# EAGLE design VM_Motor_v2.1 (EAGLE 7.0.0)
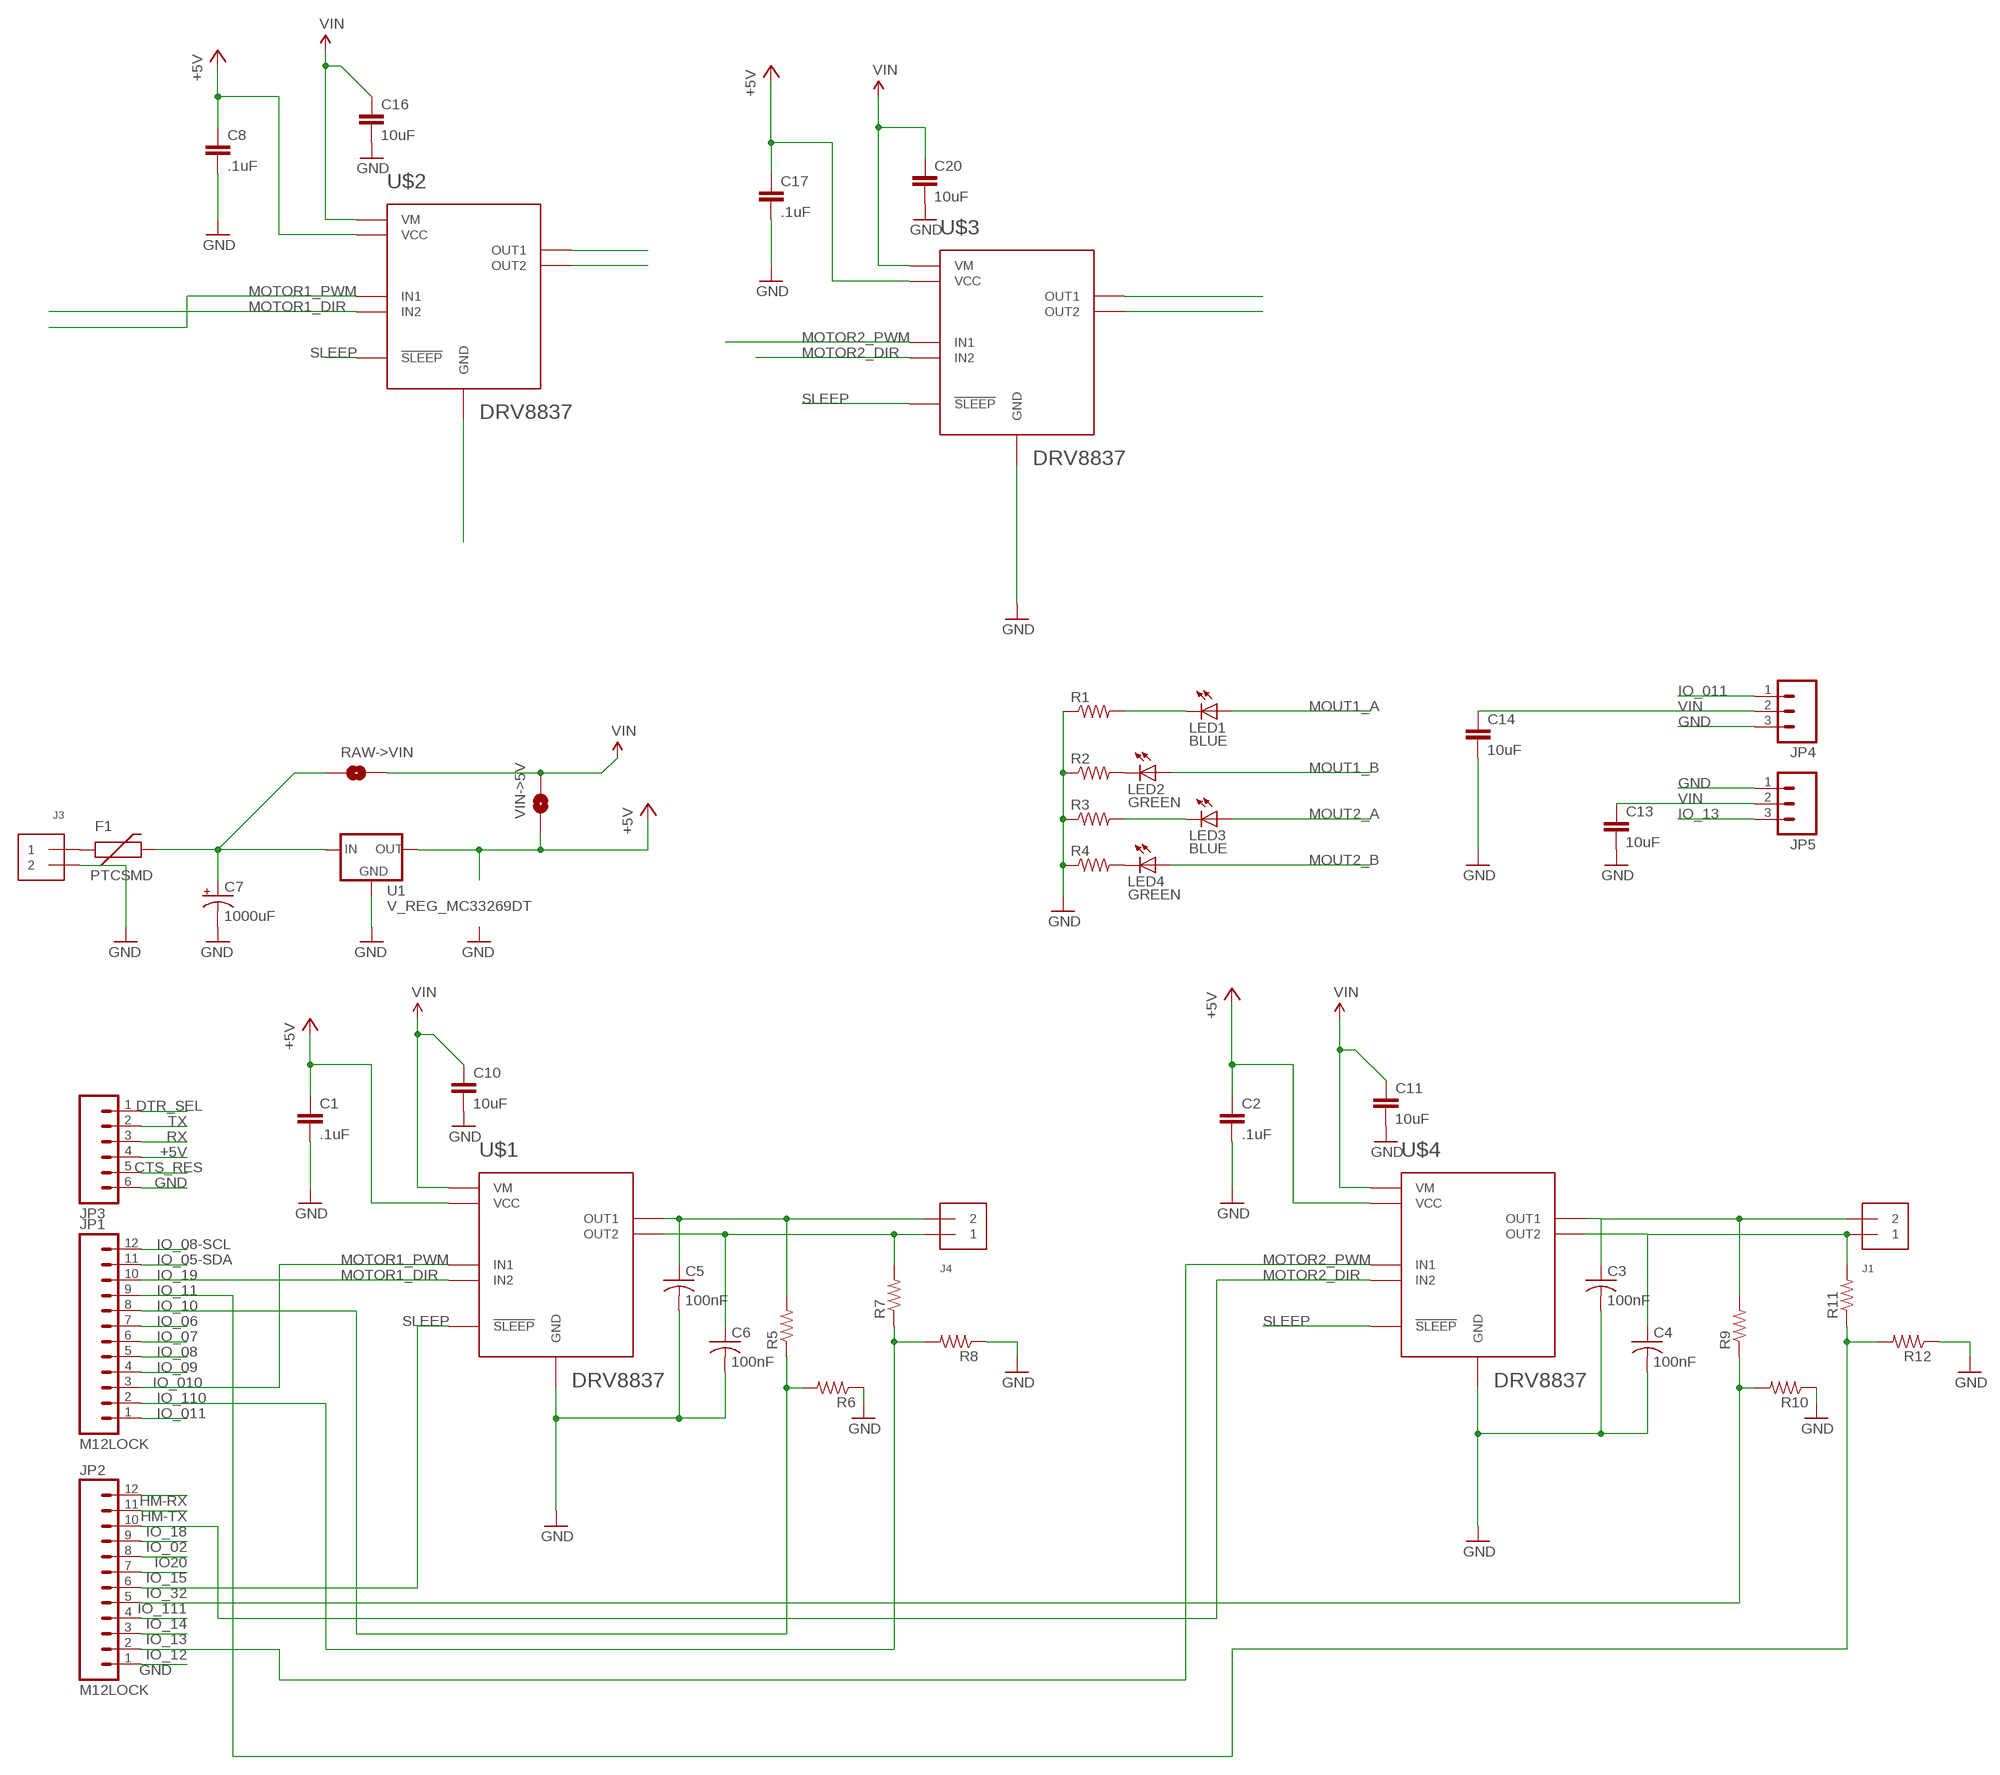
[diagram p0: schematic, sheet 1]

## Parts
C1  .1uF  CAP0402-CAP  [0402-CAP]
C2  .1uF  CAP0402-CAP  [0402-CAP]
C3  100nF  C-USC0402  [C0402]
C4  100nF  C-USC0402  [C0402]
C5  100nF  C-USC0402  [C0402]
C6  100nF  C-USC0402  [C0402]
C7  1000uF  CPOL-US150CLZ-0810  [150CLZ-0810]
C8  .1uF  CAP0402-CAP  [0402-CAP]
C10  10uF  CAP0402-CAP  [0402-CAP]
C11  10uF  CAP0402-CAP  [0402-CAP]
C13  10uF  CAP0402-CAP  [0402-CAP]
C14  10uF  CAP0402-CAP  [0402-CAP]
C16  10uF  CAP0402-CAP  [0402-CAP]
C17  .1uF  CAP0402-CAP  [0402-CAP]
C20  10uF  CAP0402-CAP  [0402-CAP]
F1  PTCSMD  [PTC-1206]
J1  TERMBLOCK_1X2  [TERMBLOCK_1X2-3.5MM]
J3  TERMBLOCK_1X2  [TERMBLOCK_1X2-3.5MM]
J4  TERMBLOCK_1X2  [TERMBLOCK_1X2-3.5MM]
JP1  M12LOCK  [1X12_LOCK]
JP2  M12LOCK  [1X12_LOCK]
JP3  M06LOCK  [1X06_LOCK]
JP4  M03LOCK  [1X03_LOCK]
JP5  M03LOCK  [1X03_LOCK]
LED1  BLUE  LEDCHIP-LED0603  [CHIP-LED0603]
LED2  GREEN  LEDCHIP-LED0603  [CHIP-LED0603]
LED3  BLUE  LEDCHIP-LED0603  [CHIP-LED0603]
LED4  GREEN  LEDCHIP-LED0603  [CHIP-LED0603]
R1  R-US_R0402  [R0402]
R2  R-US_R0402  [R0402]
R3  R-US_R0402  [R0402]
R4  R-US_R0402  [R0402]
R5  R-US_R0402  [R0402]
R6  R-US_R0402  [R0402]
R7  R-US_R0402  [R0402]
R8  R-US_R0402  [R0402]
R9  R-US_R0402  [R0402]
R10  R-US_R0402  [R0402]
R11  R-US_R0402  [R0402]
R12  R-US_R0402  [R0402]
RAW->VIN  SOLDERJUMPERNO  [SJ_2S-NO]
U1  V_REG_MC33269DT  [DPAK]
U$1  DRV8837  [QFN8]
U$2  DRV8837  [QFN8]
U$3  DRV8837  [QFN8]
U$4  DRV8837  [QFN8]
VIN->5V  SOLDERJUMPERNO  [SJ_2S-NO]

## Nets
+5V: C1.1 C2.1 C8.1 C17.1 JP3.4 U1.4(OUT) U$1.P$8(VCC) U$2.P$8(VCC) U$3.P$8(VCC) U$4.P$8(VCC) VIN->5V.1
CTS_RES: JP3.5
DTR_SEL: JP3.1
GND: C1.2 C2.2 C3.2 C4.2 C5.2 C6.2 C7.- C8.2 C10.2 C11.2 C13.2 C14.2 C16.2 C17.2 C20.2 J3.2 JP2.1 JP3.6 JP4.3 JP5.1 R1.1 R2.1 R3.1 R4.1 R6.1 R8.1 R10.1 R12.1 U1.1(GND) U$1.P$4(GND) U$1.P$9(GND) U$1.P$10(GND) U$1.P$11(GND) U$2.P$4(GND) U$2.P$9(GND) U$2.P$10(GND) U$2.P$11(GND) U$3.P$4(GND) U$3.P$9(GND) U$3.P$10(GND) U$3.P$11(GND) U$4.P$4(GND) U$4.P$9(GND) U$4.P$10(GND) U$4.P$11(GND)
HM-RX: JP2.12
HM-TX: JP2.11
IO20: JP2.8
IO_02: JP2.9
IO_05-SDA: JP1.11
IO_06: JP1.7
IO_07: JP1.6
IO_08: JP1.5
IO_08-SCL: JP1.12
IO_09: JP1.4
IO_10: JP1.8 R5.1 R6.2
IO_011: JP1.1 JP4.1
IO_11: JP1.9 R11.1 R12.2
IO_13: JP2.3 JP5.3
IO_14: JP2.4
IO_15: JP2.7
IO_110: JP1.2 R7.1 R8.2
IO_111: JP2.5 R9.1 R10.2
MOTOR1_DIR: JP1.10 U$1.P$5(IN2) U$2.P$5(IN2)
MOTOR1_PWM: JP1.3 U$1.P$6(IN1) U$2.P$6(IN1)
MOTOR2_DIR: JP2.10 U$3.P$5(IN2) U$4.P$5(IN2)
MOTOR2_PWM: JP2.2 U$3.P$6(IN1) U$4.P$6(IN1)
MOUT1_A: C5.1 J4.2 LED1.A R5.2 U$1.P$2(OUT1) U$2.P$2(OUT1)
MOUT1_B: C6.1 J4.1 LED2.A R7.2 U$1.P$3(OUT2) U$2.P$3(OUT2)
MOUT2_A: C3.1 J1.2 LED3.A R9.2 U$3.P$2(OUT1) U$4.P$2(OUT1)
MOUT2_B: C4.1 J1.1 LED4.A R11.2 U$3.P$3(OUT2) U$4.P$3(OUT2)
N$1: LED2.C R2.2
N$2: LED4.C R4.2
N$3: LED1.C R1.2
N$4: LED3.C R3.2
N$13: F1.1 J3.1
RAW: C7.+ F1.2 RAW->VIN.1 U1.3(IN)
RX: JP3.3
SLEEP: JP2.6 U$1.P$7(!SLEEP) U$2.P$7(!SLEEP) U$3.P$7(!SLEEP) U$4.P$7(!SLEEP)
TX: JP3.2
VIN: C10.1 C11.1 C13.1 C14.1 C16.1 C20.1 JP4.2 JP5.2 RAW->VIN.2 U$1.P$1(VM) U$2.P$1(VM) U$3.P$1(VM) U$4.P$1(VM) VIN->5V.2

## Notes on the sheet
- IO_19
- IO_11
- IO_010
- IO_18
- IO_32
- IO_12

## Library data of the parts
C1 C2 C8 C10 C11 C13 C14 C16 C17 C20 = SparkFun-Capacitors:CAP: Capacitor Standard 0603 ceramic capacitor, and 0.1" leaded capacitor.
C3-C6 = resistor:C-US: CAPACITOR, American symbol
C7 = resistor:CPOL-US: POLARIZED CAPACITOR, American symbol
F1 = SparkFun-PowerIC:PTC: Resettable Fuse PTC Resettable Fuse. Spark Fun Electronics SKU : COM-08357; PROD_ID: RES-11150
J1 J3 J4 = microbuilder:TERMBLOCK_1X2: 3.5mm Terminal block http://www.ladyada.net/library/pcb/eaglelibrary.html
JP1 JP2 = SparkFun-Connectors:M12: Header 12 Standard 12-pin 0.1" header. Use with straight break away headers (SKU : PRT-00116), right angle break away headers (PRT-00553), swiss pins (PRT-00743), machine pins (PRT-00117), and female headers (PRT-00115).
JP3 = SparkFun-Connectors:M06: Header 6 Standard 6-pin 0.1" header. Use with straight break away headers (SKU : PRT-00116), right angle break away headers (PRT-00553), swiss pins (PRT-00743), machine pins (PRT-00117), and female headers (PRT-00115). Molex polarized connector foot print use with SKU : PRT-08094 with associated crimp pins and housings. NOTES ON THE VARIANTS LOCK and LOCK_LONGPADS... This footprint was designed to help hold the alignment of a through-hole component (i.e. 6-pin header) while soldering it into place. You may notice that each hole has been shifted either up or down by 0.005 of an inch from it's more standard position (which is a perfectly straight line). This slight alteration caused the pins (the squares in the middle) to touch the edges of the holes. Because they are alternating, it causes a "brace" to hold the component in place. 0.005 has proven to be the perfect amount of "off-center" position when using our standard breakaway headers. Although looks a little odd when you look at the bare footprint, once you have a header in there, the alteration is very hard to notice. Also,if you push a header all the way into place, it is covered up entirely on the bottom side. This idea of altering the position of holes to aid alignment will be further integrated into the Sparkfun Library for other footprints. It can help hold any component with 3 or more connection pins.
JP4 JP5 = SparkFun-Connectors:M03: Header 3 Standard 3-pin 0.1" header. Use with straight break away headers (SKU : PRT-00116), right angle break away headers (PRT-00553), swiss pins (PRT-00743), machine pins (PRT-00117), and female headers (PRT-00115). Molex polarized connector foot print use with SKU : PRT-08232 with associated crimp pins and housings.
LED1-LED4 = led:LED: LED OSRAM: - CHIPLED LG R971, LG N971, LY N971, LG Q971, LY Q971, LO R971, LY R971 LH N974, LH R974 LS Q976, LO Q976, LY Q976 LO Q996 - Hyper CHIPLED LW Q18S LB Q993, LB Q99A, LB R99A - SideLED LS A670, LO A670, LY A670, LG A670, LP A670 LB A673, LV A673, LT A673, LW A673 LH A674 LY A675 LS A676, LA A676, LO A676, LY A676, LW A676 LS A679, LY A679, LG A679 - Hyper Micro SIDELED® LS Y876, LA Y876, LO Y876, LY Y876 LT Y87S - SmartLED LW L88C, LW L88S LB L89C, LB L89S, LG L890 LS L89K, LO L89K, LY L89K LS L896, LA L896, LO L896, LY L896 - TOPLED LS T670, LO T670, LY T670, LG T670, LP T670 LSG T670, LSP T670, LSY T670, LOP T670, LYG T670 LG T671, LOG T671, LSG T671 LB T673, LV T673, LT T673, LW T673 LH T674 LS T676, LA T676, LO T676, LY T676, LB T676, LH T676, LSB T676, LW T676 LB T67C, LV T67C, LT T67C, LS T67K, LO T67K, LY T67K, LW E67C LS E67B, LA E67B, LO E67B, LY E67B, LB E67C, LV E67C, LT E67C LW T67C LS T679, LY T679, LG T679 LS T770, LO T770, LY T770, LG T770, LP T770 LB T773, LV T773, LT T773, LW T773 LH T774 LS E675, LA E675, LY E675, LS T675 LS T776, LA T776, LO T776, LY T776, LB T776 LHGB T686 LT T68C, LB T68C - Hyper Mini TOPLED® LB M676 - Mini TOPLED Santana® LG M470 LS M47K, LO M47K, LY M47K Source: http://www.osram.convergy.de LUXEON: - LUMILED® LXK2-PW12-R00, LXK2-PW12-S00, LXK2-PW14-U00, LXK2-PW14-V00 LXK2-PM12-R00, LXK2-PM12-S00, LXK2-PM14-U00 LXK2-PE12-Q00, LXK2-PE12-R00, LXK2-PE12-S00, LXK2-PE14-T00, LXK2-PE14-U00 LXK2-PB12-K00, LXK2-PB12-L00, LXK2-PB12-M00, LXK2-PB14-N00, LXK2-PB14-P00, LXK2-PB14-Q00 LXK2-PR12-L00, LXK2-PR12-M00, LXK2-PR14-Q00, LXK2-PR14-R00 LXK2-PD12-Q00, LXK2-PD12-R00, LXK2-PD12-S00 LXK2-PH12-R00, LXK2-PH12-S00 LXK2-PL12-P00, LXK2-PL12-Q00, LXK2-PL12-R00 Source: www.luxeon.com KINGBRIGHT: KA-3528ASYC Source: www.kingbright.com
R1-R12 = resistor:R-US_: RESISTOR, American symbol
RAW->VIN VIN->5V = SparkFun-Retired:SOLDERJUMPER: Solder Jumper Standard SMD solder jumper. Used to automate production. Two varients : Normally Open and Normally Closed are the same, but have different paste layers. NC will have a large amount of paste and should jumper during reflow.
U1 = SparkFun-PowerIC:V_REG_MC33269
U$1-U$4 = bt_motordriver:DRV8837: DRV8837 Low Voltage H-Bridge The DRV8837 provides an integrated motor-driver solution for cameras, consumer products, toys, and other low-voltage or battery-powered motion-control applications. The device has one H-bridge driver, and can drive one dc motor or one winding of a stepper motor, as well as other devices like solenoids. Reference: http://www.ti.com/lit/ds/symlink/drv8837.pdf

## Board
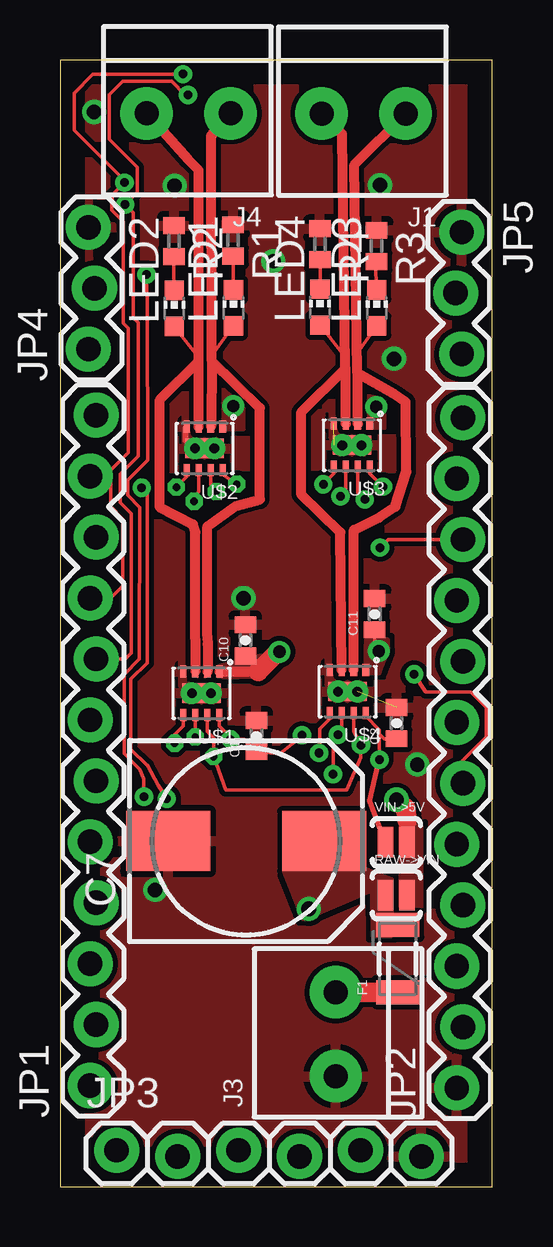
[diagram p1: board, top side]
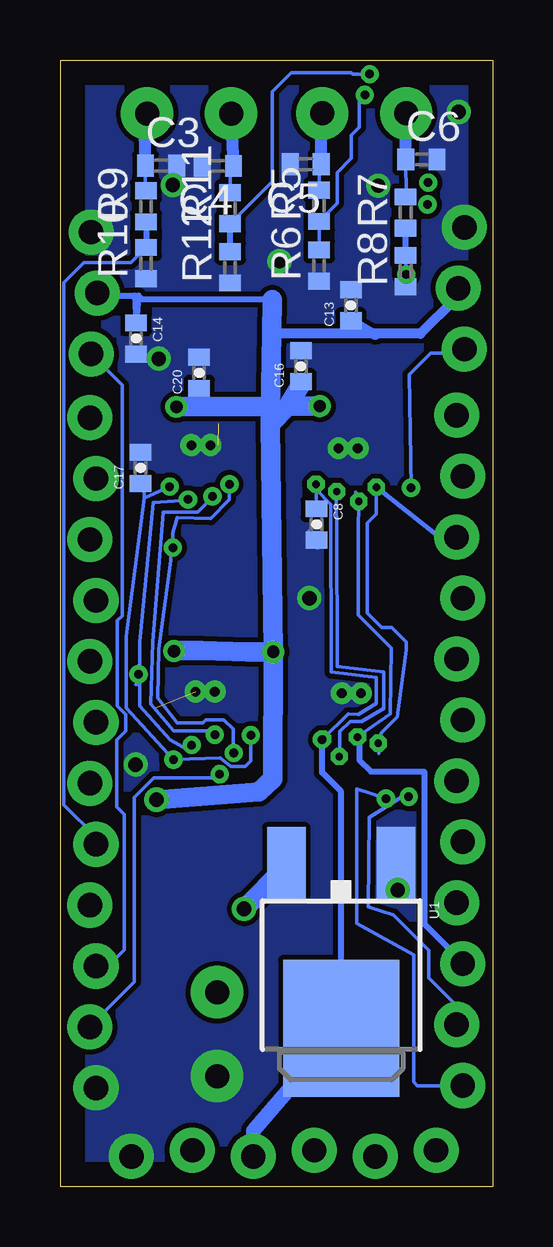
[diagram p2: board, bottom side, seen from below]

Size 18 x 46.97 mm. Coordinates in mm from the lower left corner, seen from the top.
Outline: 0,0 18,0 18,46.97 0,46.97 0,0
Copper layers (1*16): Top 0.035mm / dielectric 1.5mm / Bottom 0.035mm
Design rules "default": minimum track width 10mil, minimum drill 24mil, track to track 8mil, track to pad 8mil, pad to pad 8mil, via to via 8mil, smd to smd 8mil, copper to edge 40mil, drill to drill 8mil, minimum pad ring 10mil, minimum via ring 8mil, stop-mask expansion 4mil, vias tented up to drill 0mil, thermal gap 10mil

### Footprints (pad centres in the part's own frame; a part is rotated, then mirrored left to right if it is on the bottom)
0402-CAP = smd 0.7 x 0.9: 1 -0.65,0; 2 0.65,0
C0402 = smd 0.7 x 0.9: 1 -0.65,0; 2 0.65,0
150CLZ-0810 = smd 3.5 x 2.5: + 3.25,0; - -3.25,0
PTC-1206 = smd 1 x 1.8: 1 -1.4,0; 2 1.4,0
TERMBLOCK_1X2-3.5MM = drill 1 pad 2.184: 1 1.8,0; 2 -1.7,0
1X12_LOCK = drill 1.016 pad 1.88: 1 0,0.127; 2 2.54,-0.127; 3 5.08,0.127; 4 7.62,-0.127; 5 10.16,0.127; 6 12.7,-0.127; 7 15.24,0.127; 8 17.78,-0.127; 9 20.32,0.127; 10 22.86,-0.127; 11 25.4,0.127; 12 27.94,-0.127
1X06_LOCK = drill 1.016 pad 1.88: 1 0,0; 2 2.54,-0.254; 3 5.08,0; 4 7.62,-0.254; 5 10.16,0; 6 12.7,-0.254
1X03_LOCK = drill 1.016 pad 1.88: 1 0,0.127; 2 2.54,-0.127; 3 5.08,0.127
CHIP-LED0603 = smd 0.8 x 0.8: A 0,-0.75; C 0,0.75
R0402 = smd 0.7 x 0.9: 1 -0.65,0; 2 0.65,0
SJ_2S-NO = smd 0.635 x 1.27: 1 -0.45,0; 2 0.45,0
DPAK = smd 1.6 x 3: 1 -2.28,-5.31; 3 2.28,-5.31 | smd 4.826 x 5.715: 4 0,1.588
QFN8 = smd 0.28 x 0.5: P$1 -0.75,-0.9; P$2 -0.25,-0.9 | smd 0.25 x 0.5: P$3 0.25,-0.9; P$4 0.75,-0.9; P$5 0.75,0.9; P$6 0.25,0.9; P$7 -0.25,0.9; P$8 -0.75,0.9 | smd 1.6 x 0.8: P$9 0,0 | drill 0.4 pad 0.6: P$10 0.4,0; P$11 -0.4,0

### Placement (x,y rotation side)
C1  8.18,18.79 90 top
C2  14.03,19.32 90 top
C3  13.82,42.57 0 bottom
C4  11.45,42.55 180 bottom
C5  7.79,42.63 180 bottom
C6  2.98,42.82 0 bottom
C7  7.75,14.41 0 top
C8  7.35,27.61 270 bottom
C10  7.73,22.78 90 top
C11  13.11,23.87 90 top
C13  5.91,36.75 90 bottom
C14  14.86,35.36 270 bottom
C16  8,34.21 90 bottom
C17  14.68,29.97 90 bottom
C20  12.24,33.93 90 bottom
F1  14.07,9.51 90 top
J1  12.7,44.74 180 top
J3  11.49,6.31 90 top
J4  5.41,44.75 180 top
JP1  1.38,4.22 90 top
JP2  16.66,4.12 90 top
JP3  2.36,1.52 0 top
JP4  1.31,34.92 90 top
JP5  16.61,39.8 270 top
LED1  7.23,36.64 0 top
LED2  4.76,36.61 0 top
LED3  13.2,36.64 0 top
LED4  10.83,36.66 0 top
R1  7.21,39.44 270 top
R2  4.75,39.42 270 top
R3  13.19,39.22 270 top
R4  10.83,39.29 270 top
R5  7.24,40.89 90 bottom
R6  7.24,38.4 90 bottom
R7  3.63,40.61 90 bottom
R8  3.63,38.18 90 bottom
R9  14.45,40.87 90 bottom
R10  14.45,38.51 90 bottom
R11  10.95,40.79 90 bottom
R12  10.95,38.33 90 bottom
RAW->VIN  14.01,12.16 0 top
U1  6.32,8.19 180 bottom
U$1  5.89,20.57 180 top
U$2  6.03,30.78 180 top
U$3  12.16,30.91 180 top
U$4  11.99,20.64 180 top
VIN->5V  14.01,14.36 0 top

### Tracks (layer width: path | path; a pad name or v marks a point on that pad's centre or on a via)
+5V  (via drill 0.3, 0.36 pad 0.36)
  Top 0.152: U$1.P$8 6.64,19.21 7.09,18.77 v7.09,18.67 | U$2.P$8 6.78,29.7 v7.37,29.29 | U$4.P$8 12.74,19.62 13.31,19.05 13.31,18.87 | 13.31,18.87 v13.31,17.8 | U$3.P$8 12.91,29.74 v13.46,29.18 | v10.08,18.82 9.91,18.64 9.16,18.03 C1.1 7.68,18.64 v7.11,18.64 | C2.1 13.51,18.68 13.31,18.87
  Top 0.203: VIN->5V.1 12.9,16.08 v13.31,17.8
  Bottom 0.152: 7.09,18.64 v7.09,18.67 6.02,19.71 5.61,19.68 4.85,20.14 4.85,21.23 6.73,21.46 6.76,28.45 7.37,29.06 v7.37,29.29 | v7.37,29.29 7.16,29.29 | v13.31,17.8 13.31,17.98 | 13.46,29.16 v13.46,29.18 14.53,28.7 | 14.53,28.7 15.27,22.96 15.27,19.96 v13.31,17.8 | v10.08,18.82 10.08,17.75 10.31,17.53 10.92,17.53 11.35,17.88 13.26,17.8 v13.31,17.8 | v7.37,29.29 7.37,28.98 C8.1 | 14.53,28.7 14.53,29.17 C17.1
  Bottom 0.254: U1.4 6.32,16.48 7.11,17.27 v7.11,18.64 v7.09,18.67
  Bottom 0.61: JP3.4 9.98,2.33 U1.4
GND  (via drill 0.6)  (2 unrouted)
  Top 0.254: U$2.P$4 5.24,31.59 5.24,31.11 5.56,30.8 U$2.P$10 | U$3.P$10 11.43,30.8 11.43,30.91
  Bottom 0.254: 7.3,26.99 C8.2 | 7.3,26.67 C8.2 | 7.62,27.3 C8.2
  other vias: 3.96,12.37 7.65,24.54 8.89,38.58 13.34,41.76 1.42,44.81 4.78,41.73 13.92,34.52 14.88,17.6
  pour Bottom (rank 6, no thermals): 18.1,46.8 18.3,46.8 18.3,-0.9 0.2,-0.9 0.2,47 18.1,47
  pour Top (rank 6): 18.1,46.8 18.3,46.8 18.3,-0.9 0.2,-0.9 0.2,47 18.1,47
IO_10  (via drill 0.36)
  Top 0.152: JP1.8 2.72,22 2.97,22.25 2.97,28.07 2.52,28.52 2.52,29.72 3.25,30.45 3.25,36.02 3.05,36.22 3.05,40.62 v2.72,40.95 3.23,41.45 3.23,42.49 2.06,43.66 2.06,45.52 2.62,46.08 4.65,46.08 5.21,45.52 v5.33,45.52
  Bottom 0.152: R6.2 R5.1 6.49,41 6.49,42.28 5.89,42.88 5.89,43.84 5.56,44.17 5.56,45.29 v5.33,45.52
IO_011  (via drill 0.36, 0.36 pad 0.36)
  Top 0.152: v4.45,16.18 4.09,16.74 3.63,17.58 3.61,17.58 2.95,18.24 2.95,21.16 3.63,21.84 3.63,28.98 v3.4,29.13
  Bottom 0.152: JP1.1 3.15,4.22 3.3,4.37 3.3,9.68 5.66,10.97 5.66,16.59 v4.45,16.18 | v3.4,29.13 3.48,33.86 2.59,34.75 1.35,34.75 JP4.1
IO_11  (via drill 0.36)
  Top 0.152: JP1.9 2.11,24.54 2.62,25.04 2.62,27.84 2.11,28.35 2.11,29.87 2.85,30.61 2.85,35.79 2.64,35.99 2.64,40.23 2.16,40.72 2.18,41.35 v2.69,41.86 2.69,41.94 0.58,44.04 0.58,45.59 1.37,46.38 v5.13,46.38
  Bottom 0.152: R11.1 9.2,41.9 9.2,45.64 8.41,46.43 5.89,46.43 5.84,46.38 v5.13,46.38
  Bottom 0.254: R12.2 10.95,39.05 10.95,40.01 R11.1 10.79,40.16 10.64,40.32
IO_13
  Bottom 0.152: JP2.3 16.05,9.2 15.37,9.88 15.37,15.52 15.67,15.82 15.67,18.62 15.29,19 15.29,19.68 15.65,20.04 15.65,23.6 15.44,23.8 15.44,33.42 JP5.3
IO_110  (via drill 0.36)
  Top 0.152: v3.5,16.26 3.48,16.99 3.33,17.4 2.67,18.06 2.67,21.36 3.3,22 3.33,28.32 2.82,28.83 2.82,29.46 3.66,30.3 3.63,36.4 v3.61,38.02
  Bottom 0.152: JP1.2 1.51,7.55 2.67,8.71 2.67,9.86 4.14,11.33 5.18,11.66 5.16,15.39 3.58,16.38 v3.5,16.26 | v3.61,38.02 R8.2
  Bottom 0.254: R8.2 3.65,38.89 3.65,39.85 R7.1
IO_111
  Bottom 0.152: JP2.5 16.53,14.58 17.88,15.93 17.88,37.69 17.04,38.53 15.08,38.53 R10.2
  Bottom 0.254: R10.2 14.45,39.21 14.45,40.16 R9.1
MOTOR1_DIR  (via drill 0.3)
  Top 0.152: U$1.P$5 5.14,19.22 4.78,18.85 v4.78,18.49 | U$2.P$5 5.28,29.61 v4.85,29.16
  Bottom 0.152: 4.75,18.06 v4.78,18.49 4.78,18.67 4.62,18.95 3.99,19.58 3.61,22.38 3.61,22.71 4.22,23.32 4.62,23.32 5.23,23.93 5.23,27.66 4.85,28.04 v4.85,29.16
  Bottom 0.203: JP1.10 2.23,27.08 v4.85,29.16
MOTOR1_PWM  (via drill 0.3)
  Top 0.152: U$1.P$6 v5.64,18.75 | U$2.P$6 5.78,28.99 v5.59,28.57
  Bottom 0.152: 5.64,18.69 v5.64,18.75 4.27,19.71 4.24,22.45 5.61,23.82 5.61,27.84 5.59,28.02 v5.59,28.57 5.71,28.96
  Bottom 0.254: JP1.3 1.27,9.37 2.86,10.95 2.86,17.3 5.08,17.3 5.56,17.78 5.56,18.73 v5.64,18.75
MOTOR2_DIR  (via drill 0.36 pad 0.36)
  Top 0.152: U$4.P$5 11.24,19.49 10.82,19.07 10.82,18.11 v10.79,18.09 | U$3.P$5 11.41,29.72 v10.97,29.29 | JP2.10 13.67,26.98 v13.34,26.64
  Bottom 0.152: v10.97,29.29 10.97,28.65 11.76,27.86 13.16,27.89 13.34,27.25 v13.34,26.64 13.41,26.57 13.41,26.11 13.92,22.43 13.97,20.37 13.16,19.33 12.09,19.33 11.96,19.46 11.2,19.46 10.82,19.07 10.82,18.11 v10.79,18.09
MOTOR2_PWM  (via drill 0.36, 0.36 pad 0.36)
  Top 0.152: U$4.P$6 11.74,19 v11.58,18.85 11.38,18.64 v11.38,17.2 | U$3.P$6 11.91,29 v11.68,28.78
  Bottom 0.152: 11.58,18.8 v11.58,18.85 11.89,19 13.28,19 14.25,20.12 14.17,22.71 13.74,28.12 12.29,28.12 11.68,28.73 11.63,28.73 v11.68,28.78 | JP2.2 16.79,6.68 14.94,8.53 14.94,16.23 14.12,17.04 11.53,17.04 v11.38,17.2
  Bottom 0.254: 11.75,28.89 v11.68,28.78
MOUT1_A
  Top 0.152: 6.3,31.7 U$2.P$2 | U$1.P$2 | 6.33,34.42 6.33,34.66 LED1.A
  Top 0.406: 6.33,34.42 8.33,32.46 8.33,28.65 7.32,28.37 6.14,27.53 6.14,22.93 6.15,22.61 U$1.P$2 | 6.33,34.42 6.3,31.7 | 6.33,34.42 6.3,43.81 J4.2
  Bottom 0.152: R5.2 7.24,42.6 C5.1
  Bottom 0.406: 7.17,44.69 J4.2
  Bottom 0.508: C5.1 7.17,44.69
  pour Top (no thermals): 5.99,21.21 5.99,22.43 6.3,22.43 6.3,21.21
MOUT1_B
  Top 0.152: 5.64,21.48 U$1.P$3 | 5.78,34.42 5.78,34.57 LED2.A
  Top 0.406: J4.1 5.33,42.82 5.78,42.38 5.78,34.42 | 5.64,21.48 5.64,22.58 5.64,22.8 5.64,27.29 5.54,27.61 4.17,28.32 4.17,32.81 5.78,34.42 | U$2.P$3 5.78,34.42
  Bottom 0.152: C6.1 3.61,41.28 R7.2
  Bottom 0.406: 3.64,44.72 J4.1
  Bottom 0.508: C6.1 3.64,44.72
  pour Top (no thermals): 5.49,21.21 5.49,22.43 5.79,22.43 5.82,21.21
MOUT2_A
  Top 0.152: 12.39,33.91 12.39,34.76 LED3.A
  Top 0.406: U$4.P$2 12.24,22.91 12.24,27.38 13.28,27.89 13.97,28.35 14.43,29.79 14.4,32.72 13.92,33.05 12.39,33.91 | 12.39,33.91 12.39,31.83 U$3.P$2 | 12.39,33.91 12.27,42.6 J1.2
  Bottom 0.152: C3.1 14.47,41.54 R9.2
  Bottom 0.406: 14.51,44.63 J1.2
  Bottom 0.508: C3.1 14.51,44.63
MOUT2_B
  Top 0.152: 11.89,34.11 11.89,34.58 LED4.A
  Top 0.406: U$4.P$3 11.69,27.28 10.06,28.85 10.06,32.28 11.89,34.11 | 11.89,34.11 11.89,31.83 U$3.P$3 | 11.89,34.11 11.76,43.88 J1.1
  Bottom 0.152: R11.2 10.95,42.56 C4.1
  Bottom 0.406: J1.1
  Bottom 0.508: C4.1 J1.1
N$1
  Top 0.152: LED2.C 4.74,38.27 R2.2
N$2
  Top 0.152: LED4.C 10.84,38.49 R4.2
N$3
  Top 0.152: LED1.C 7.23,38.78 R1.2
N$4
  Top 0.152: LED3.C 13.14,38.48 R3.2
N$13
  Top 0.813: J3.1 F1.1
RAW  (via drill 0.61 pad 0.61)
  Bottom 0.254: U1.3 8.6,13.35
  Bottom 0.813: 8.6,13.35 v10.36,11.58
  pour Top (no thermals): 13.82,10.49 13.82,12.8 12.95,13.13 12.8,13.21 9.32,13.21 10.13,11.18 13,12.4 13.03,10.49
SLEEP  (via drill 0.3, 0.36, 0.36 pad 0.36)
  Top 0.152: U$1.P$7 6.14,18.98 6.4,18.72 v6.4,17.93 6.91,16.54 11.94,16.54 12.52,17.91 12.52,18.39 v12.55,18.41 12.24,18.98 U$4.P$7 | U$2.P$7 6.28,29.26 v6.5,28.98 | U$3.P$7 12.41,28.94 v12.7,28.65 | JP2.6 16.79,17.78 17.75,18.75 17.75,19.99 17.12,20.62 15.24,20.62 v14.76,21.36
  Bottom 0.152: 6.4,17.91 v6.4,17.93 6.38,17.96 6.38,18.97 5.94,19.41 5.46,19.41 4.55,19.94 4.55,21.46 6.48,21.69 6.5,27.66 6.53,28.3 6.53,28.93 v6.5,28.98 | 12.42,18.69 v12.55,18.41 12.72,18.24 13.44,18.62 14.71,20.04 14.71,20.88 | v12.7,28.65 12.7,28.63 14.15,28.52 14.71,22.71 14.71,20.88 | v14.76,21.36 14.76,20.93 | 14.88,20.93 14.76,20.93 | 14.76,20.93 14.71,20.88
VIN  (via drill 0.51 pad 0.51, 0.61 pad 0.61)
  Top 0.152: C11.1 13.11,22.5 v13.28,22.33
  Top 0.406: U$1.P$1 8.27,21.48 | 9.14,22.25 v9.14,22.3 9.14,22.35
  Top 0.508: VIN->5V.2 14.46,15.27
  Top 0.813: 14.46,15.27 14.4,15.77 v14.02,16.13 | 8.27,21.48 9.14,22.35
  Bottom 0.152: 9.45,32.51 9.27,32.33 | v13.18,32.51 13.01,32.51 C20.1 | 4.88,35.5 4.83,35.56
  Bottom 0.254: JP5.2 16.35,37.15 14.92,37.15 C14.1 14.76,37.15 14.61,36.99 9.53,36.99 9.19,36.98 | 1.59,36.99 1.59,37.31 JP4.2 | 8.89,35.56 9.21,35.57
  Bottom 0.406: 8.03,33.39 C16.1 | 1.59,36.99 3.02,35.56 4.83,35.56 8.89,35.56 | C13.1 4.88,35.5
  Bottom 0.813: v14.02,16.13 9.75,16.46 9.17,16.99 v9.14,22.3 | v9.14,22.3 9.27,31.8 | 9.27,31.8 9.27,32.33 9.21,35.57 9.19,36.98 | v7.21,32.54 8.53,32.54 | 8.53,32.54 9.27,31.8 | v9.14,22.3 10.21,22.3 12.17,22.35 12.98,22.35 v13.28,22.33 | v13.18,32.51 9.45,32.51 | 8.53,32.54 8.03,33.39
  pour Top (no thermals): 14.22,10.36 14.22,15.04 15.04,15.04 15.04,10.36
  pour Top (no thermals): 6.83,31.6 7.65,31.6 7.65,32.61 6.83,33.43
  pour Top (no thermals): 8.36,21.29 8.41,22.12 6.58,21.67 6.55,21.26
  pour Top (no thermals): 12.67,21.44 13.28,21.41 13.67,22.38 13.67,22.78 12.75,22.78
  pour Top (no thermals): 12.8,31.67 13.51,31.65 13.49,32.79 12.78,32.97